# EAGLE design ADS1220RTD_BREWNO_V2 (EAGLE 7.5.0)
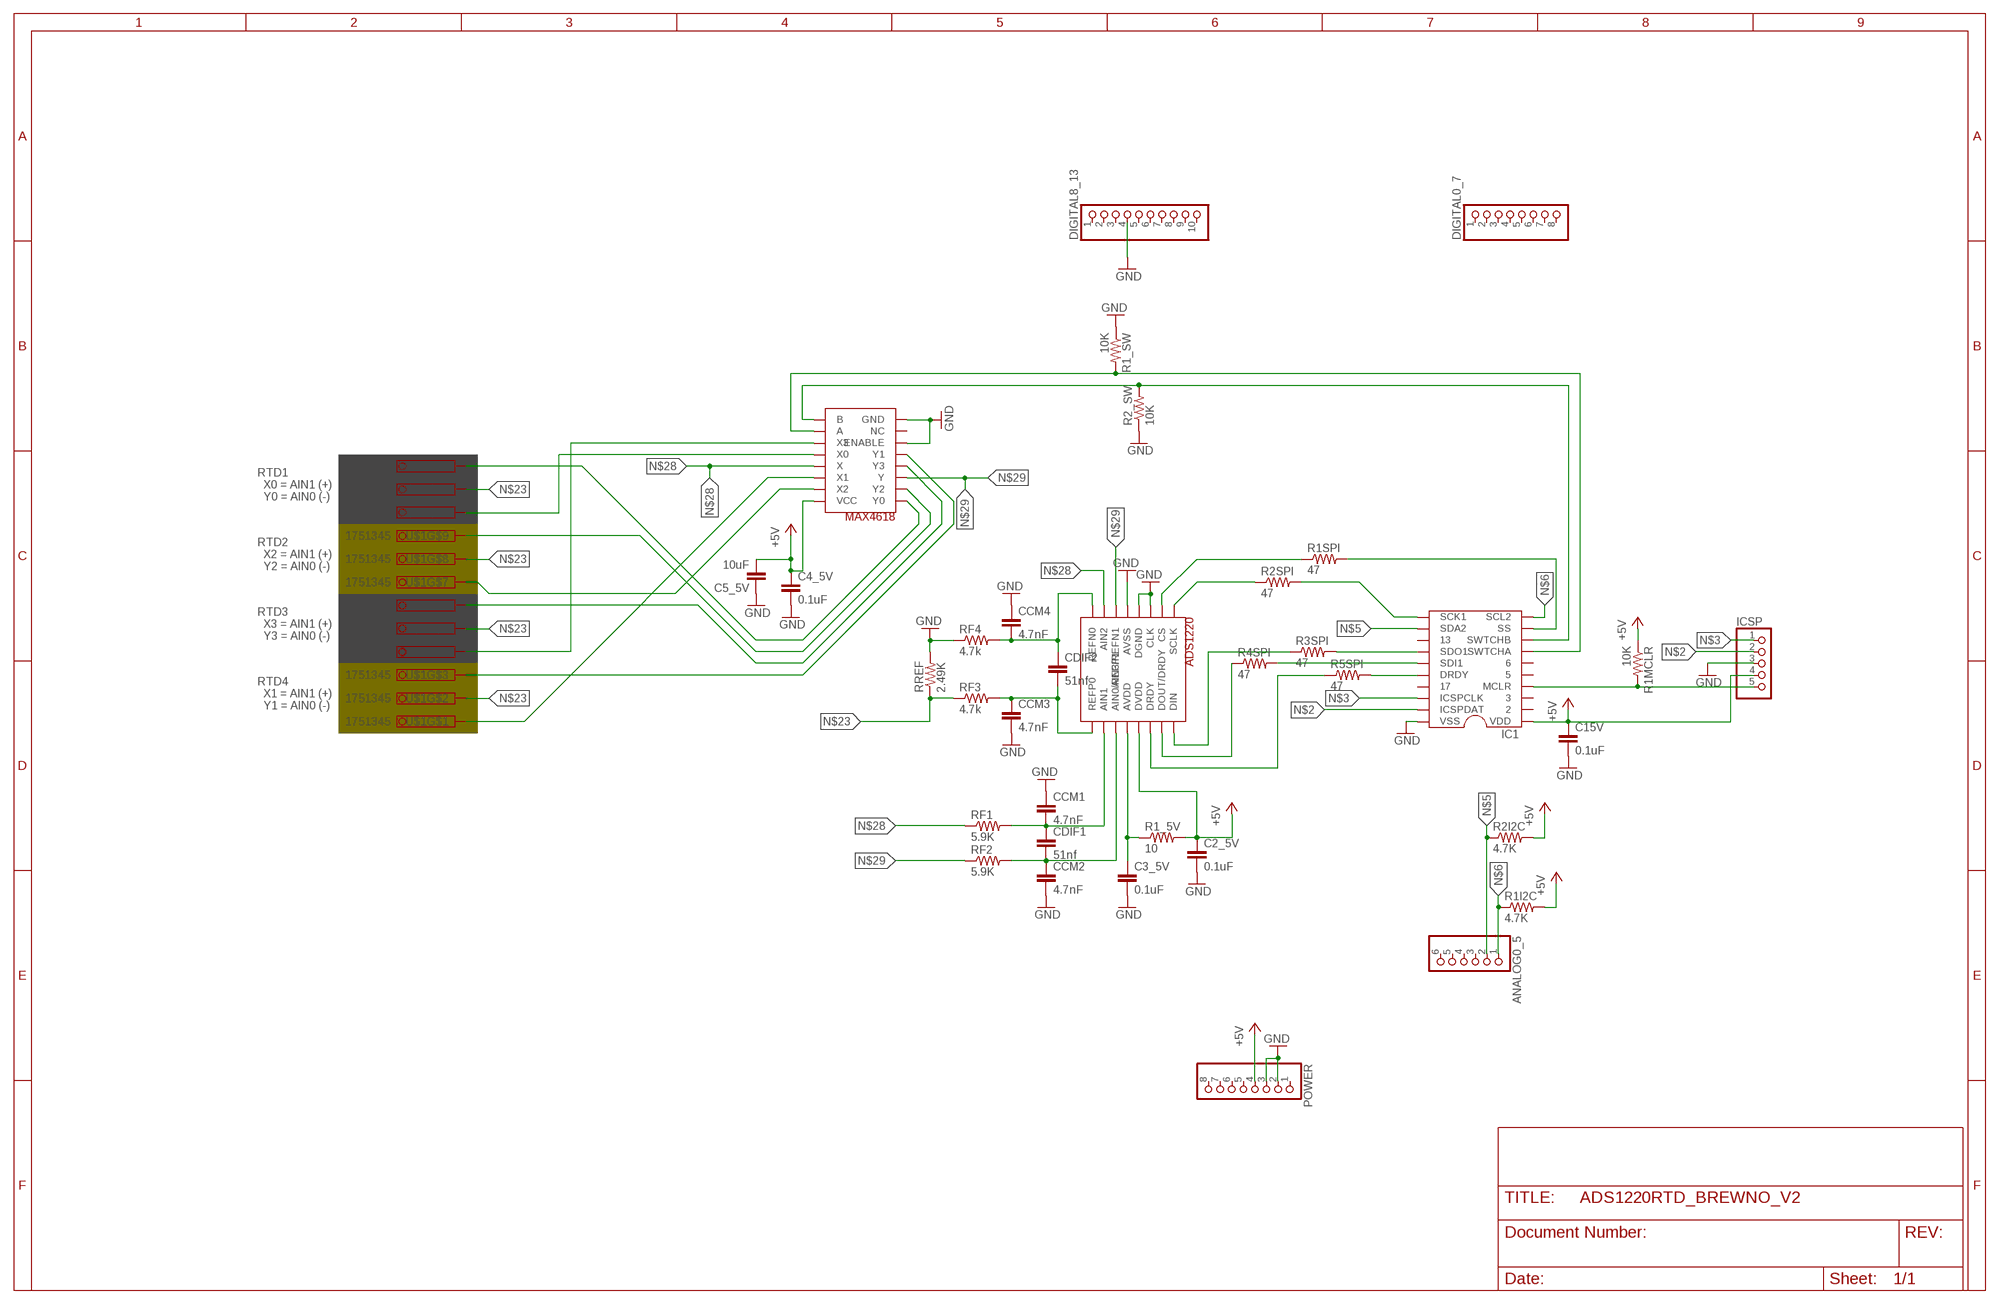
[diagram p0: schematic, sheet 1]

## Parts
ADS1220  ADS1220  [TSSOP16]
ANALOG0_5  PINHD-1X6  [1X06]
C2_5V  0.1uF  C-EUC0603  [C0603]
C3_5V  0.1uF  C-EUC0603  [C0603]
C4_5V  0.1uF  C-EUC0603  [C0603]
C5_5V  10uF  C-EUC0603  [C0603]
C15V  0.1uF  C-EUC0603  [C0603]
CCM1  4.7nF  C-EUC0603  [C0603]
CCM2  4.7nF  C-EUC0603  [C0603]
CCM3  4.7nF  C-EUC0603  [C0603]
CCM4  4.7nF  C-EUC0603  [C0603]
CDIF1  51nf  C-EUC1206  [C1206]
CDIF2  51nf  C-EUC1206  [C1206]
DIGITAL0_7  PINHD-1X8  [1X08]
DIGITAL8_13  PINHD-1X10  [1X10]
IC1  DIL20  [DIL20]
ICSP  PINHD-1X5  [1X05]
MAX4618  MAX4618CPE  [SO16]
POWER  PINHD-1X8  [1X08]
R1_5V  10  R-US_R0603  [R0603]
R1_SW  10K  R-US_R0603  [R0603]
R1I2C  4.7K  R-US_R0603  [R0603]
R1MCLR  10K  R-US_R0603  [R0603]
R1SPI  47  R-US_R0603  [R0603]
R2_SW  10K  R-US_R0603  [R0603]
R2I2C  4.7K  R-US_R0603  [R0603]
R2SPI  47  R-US_R0603  [R0603]
R3SPI  47  R-US_R0603  [R0603]
R4SPI  47  R-US_R0603  [R0603]
R5SPI  47  R-US_R0603  [R0603]
RF1  5.9K  R-US_R0603  [R0603]
RF2  5.9K  R-US_R0603  [R0603]
RF3  4.7k  R-US_R0603  [R0603]
RF4  4.7k  R-US_R0603  [R0603]
RREF  2.49K  R-US_R0603  [R0603]
U$1  1751345  [1751345]

## Nets
+5V: ADS1220.13(DVDD) C2_5V.1 C4_5V.1 C5_5V.2 C15V.1 IC1.1(VDD) ICSP.4 MAX4618.16(VCC) POWER.4 R1_5V.2 R1I2C.2 R1MCLR.1 R2I2C.2
GND: ADS1220.3(CLK) ADS1220.4(DGND) ADS1220.5(AVSS) C2_5V.2 C3_5V.2 C4_5V.2 C5_5V.1 C15V.2 CCM1.1 CCM2.2 CCM3.2 CCM4.1 DIGITAL8_13.4 IC1.20(VSS) ICSP.3 MAX4618.6(ENABLE) MAX4618.8(GND) POWER.2 POWER.3 R1_SW.1 R2_SW.1 RF4.1 RREF.2
N$1: IC1.4(MCLR) ICSP.5 R1MCLR.2
N$2: IC1.19(ICSPDAT) ICSP.2
N$3: IC1.18(ICSPCLK) ICSP.1
N$4: IC1.11(SCK1) R2SPI.2
N$5: ANALOG0_5.2 IC1.12(SDA2) R2I2C.1
N$6: ANALOG0_5.1 IC1.10(SCL2) R1I2C.1
N$7: ADS1220.1(SCLK) R2SPI.1
N$8: ADS1220.2(CS) R1SPI.1
N$9: IC1.9(SS) R1SPI.2
N$10: IC1.14(SDO1) R3SPI.2
N$11: IC1.15(SDI1) R4SPI.2
N$12: ADS1220.14(DRDY) R5SPI.1
N$13: ADS1220.12(AVDD) C3_5V.1 R1_5V.1
N$14: IC1.16(DRDY) R5SPI.2
N$15: ADS1220.16(DIN) R3SPI.1
N$17: ADS1220.15(DOUT/DRDY) R4SPI.1
N$18: IC1.8(SWTCHB) MAX4618.9(B) R2_SW.2
N$19: IC1.7(SWTCHA) MAX4618.10(A) R1_SW.2
N$21: ADS1220.8(REFN0) CCM4.2 CDIF2.1 RF4.2
N$22: ADS1220.9(REFP0) CCM3.1 CDIF2.2 RF3.2
N$23: RF3.1 RREF.1 U$1.2 U$1.5 U$1.8 U$1.11
N$26: ADS1220.11(AIN0/REFP1) CCM2.1 CDIF1.2 RF2.2
N$27: ADS1220.10(AIN1) CCM1.2 CDIF1.1 RF1.2
N$28: ADS1220.7(AIN2) MAX4618.13(X) RF1.1
N$29: ADS1220.6(AIN3/REFN1) MAX4618.3(Y) RF2.1
N$30: MAX4618.1(Y0) U$1.12
N$31: MAX4618.12(X0) U$1.10
N$32: MAX4618.2(Y2) U$1.9
N$33: MAX4618.4(Y3) U$1.6
N$34: MAX4618.15(X2) U$1.7
N$35: MAX4618.5(Y1) U$1.3
N$36: MAX4618.14(X1) U$1.1
N$37: MAX4618.11(X3) U$1.4
Unconnected: ANALOG0_5.3 ANALOG0_5.4 ANALOG0_5.5 ANALOG0_5.6 DIGITAL0_7.1 DIGITAL0_7.2 DIGITAL0_7.3 DIGITAL0_7.4 DIGITAL0_7.5 DIGITAL0_7.6 DIGITAL0_7.7 DIGITAL0_7.8 DIGITAL8_13.1 DIGITAL8_13.2 DIGITAL8_13.3 DIGITAL8_13.5 DIGITAL8_13.6 DIGITAL8_13.7 DIGITAL8_13.8 DIGITAL8_13.9 DIGITAL8_13.10 IC1.2 IC1.3 IC1.5 IC1.6 IC1.13 IC1.17 MAX4618.7(NC) POWER.1 POWER.5 POWER.6 POWER.7 POWER.8

## Notes on the sheet
- RTD1
    X0 = AIN1 (+)
    Y0 = AIN0 (-)
- RTD2
    X2 = AIN1 (+)
    Y2 = AIN0 (-)
- RTD3
    X3 = AIN1 (+)
    Y3 = AIN0 (-)
- RTD4
    X1 = AIN1 (+)
    Y1 = AIN0 (-)

## Library data of the parts
ADS1220 = ADS1220:ADS1220
ANALOG0_5 = pinhead:PINHD-1X6: PIN HEADER
C2_5V C3_5V C4_5V C5_5V C15V CCM1-CCM4 CDIF1 CDIF2 = rcl:C-EU: CAPACITOR, European symbol
DIGITAL0_7 POWER = pinhead:PINHD-1X8: PIN HEADER
DIGITAL8_13 = pinhead:PINHD-1X10: PIN HEADER
IC1 = DW_DPIPs:DIL20: Dual In Line / Socket
ICSP = pinhead:PINHD-1X5: PIN HEADER
MAX4618 = maxim:MAX4618CPE
R1_5V R1_SW R1I2C R1MCLR R1SPI R2_SW R2I2C R2SPI R3SPI R4SPI R5SPI RF1-RF4 RREF = rcl:R-US_: RESISTOR, American symbol
U$1 = con-phoenix-350:1751345

## Board
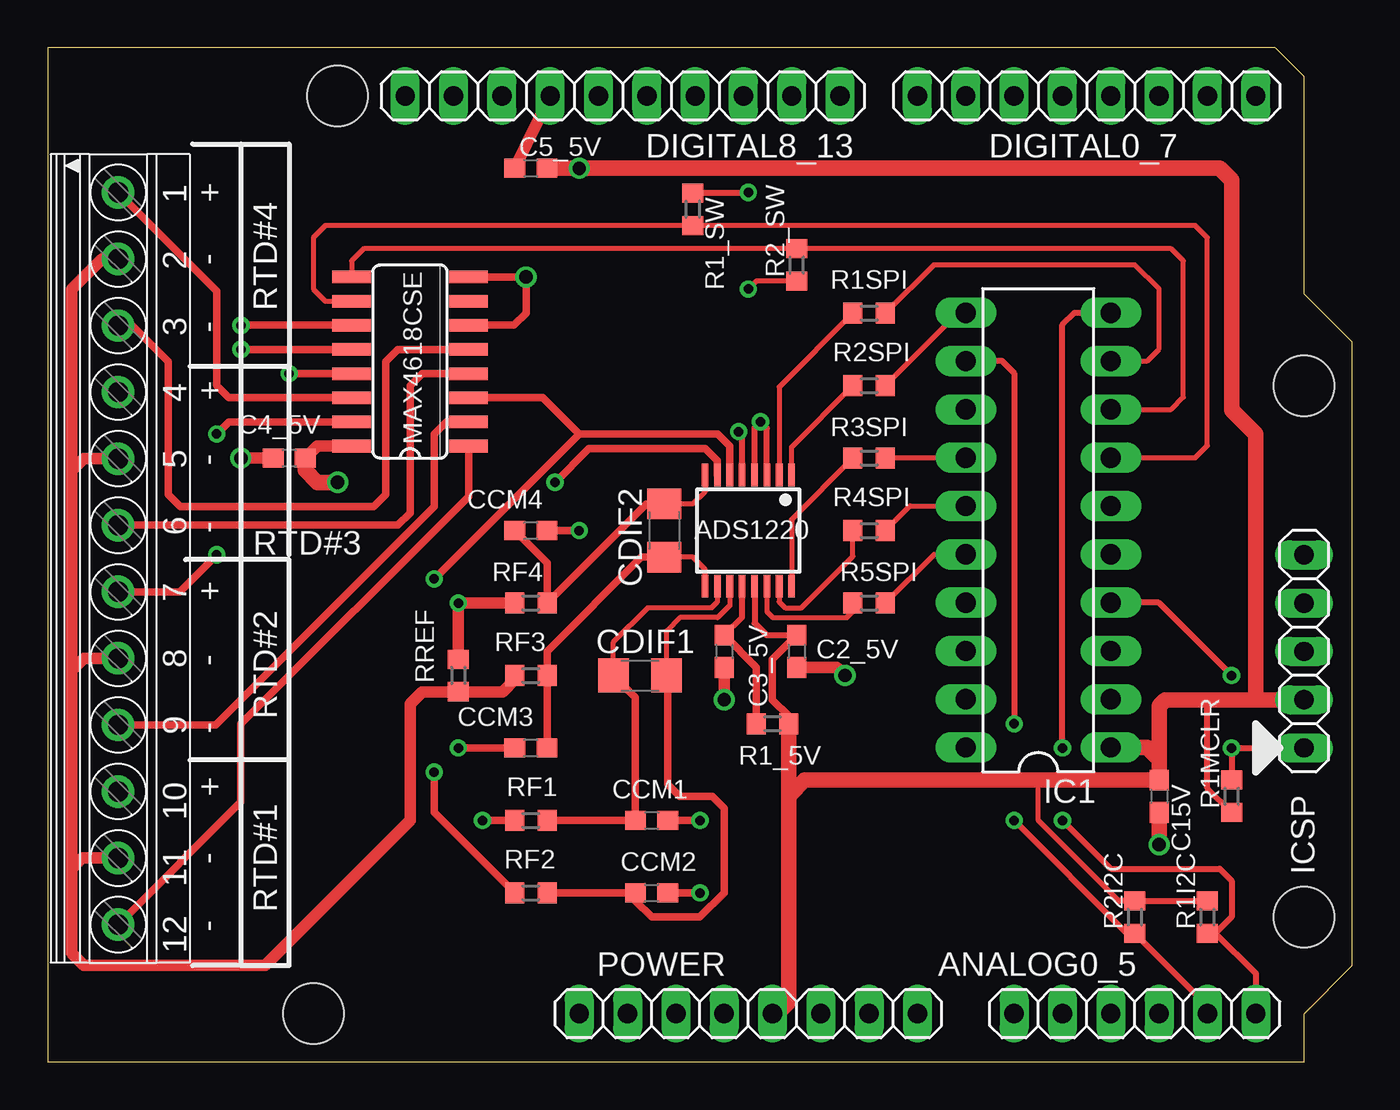
[diagram p1: board, top side]
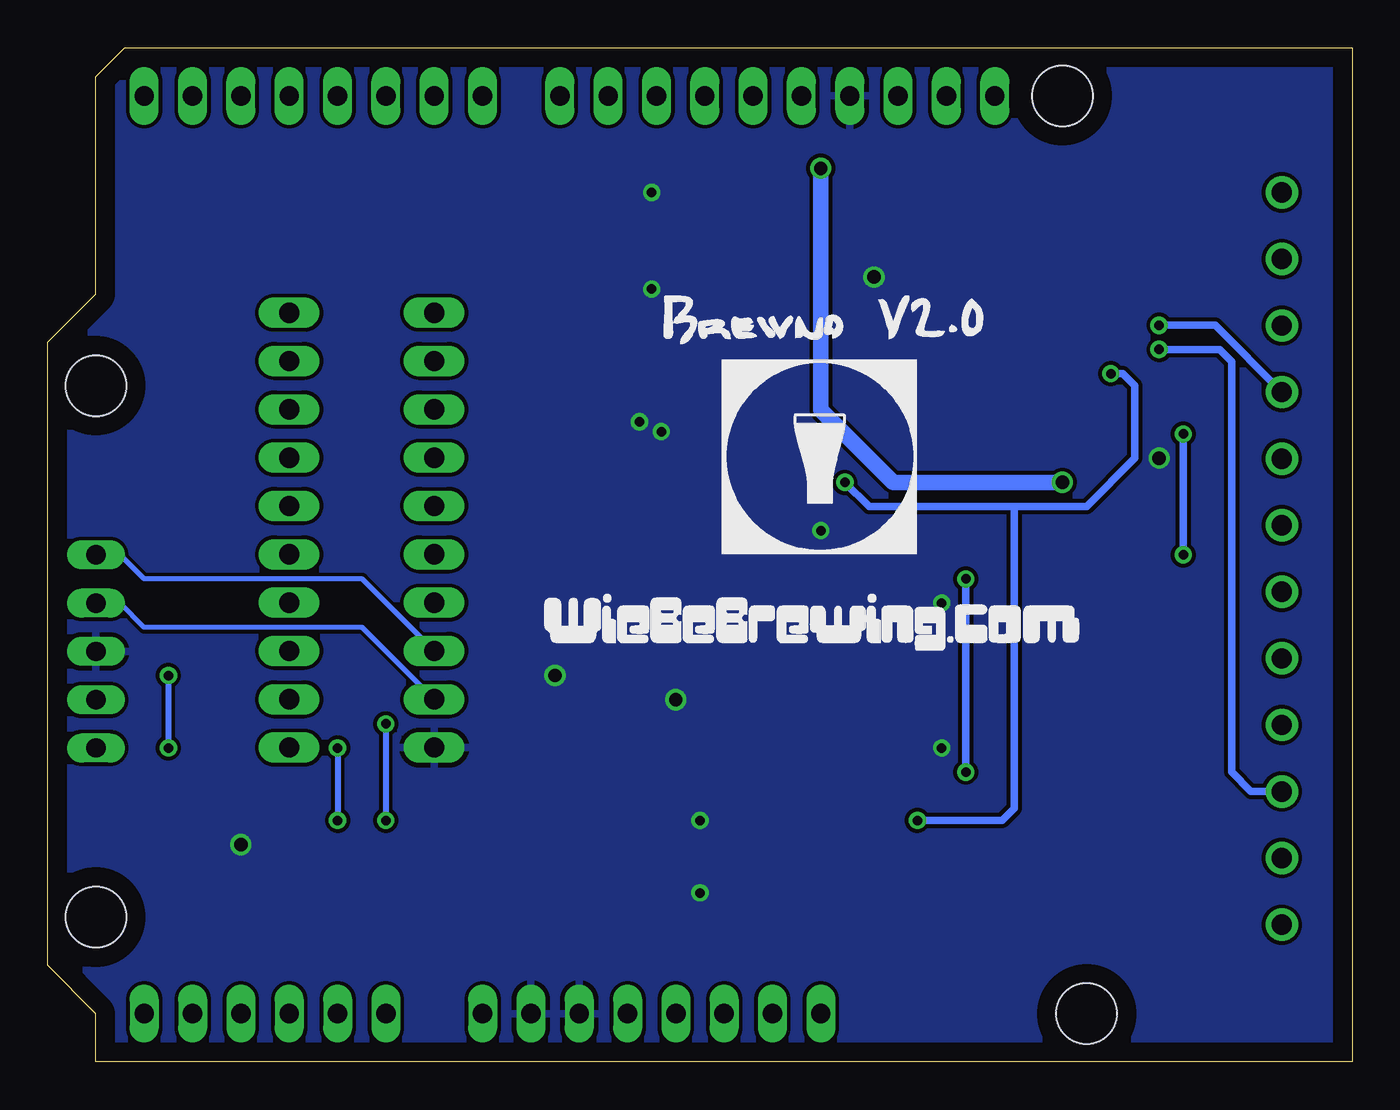
[diagram p2: board, bottom side, seen from below]

Size 68.58 x 53.34 mm. Coordinates in mm from the lower left corner, seen from the top.
Outline: 0,0 66.04,0 66.04,2.54 68.58,5.08 68.58,37.85 66.04,40.39 66.04,51.82 64.52,53.34 0,53.34 0,0
Copper layers (1*16): Top 0.035mm / dielectric 1.5mm / Bottom 0.035mm
Design rules "default *": minimum track width 10mil, minimum drill 19mil, track to track 8mil, track to pad 8mil, pad to pad 8mil, via to via 8mil, smd to smd 8mil, copper to edge 40mil, drill to drill 8mil, minimum pad ring 10mil, minimum via ring 8mil, stop-mask expansion 4mil, vias tented up to drill 0mil, thermal gap 10mil
Holes 3.17 mm at 15.24,50.8 66.04,35.56 66.04,7.62 13.97,2.54

### Footprints (pad centres in the part's own frame; a part is rotated, then mirrored left to right if it is on the bottom)
TSSOP16 = smd 0.35 x 1.2: 1 -2.275,-2.925; 2 -1.625,-2.925; 3 -0.975,-2.925; 4 -0.325,-2.925; 5 0.325,-2.925; 6 0.975,-2.925; 7 1.625,-2.925; 8 2.275,-2.925; 9 2.275,2.925; 10 1.625,2.925; 11 0.975,2.925; 12 0.325,2.925; 13 -0.325,2.925; 14 -0.975,2.925; 15 -1.625,2.925; 16 -2.275,2.925
1X06 = drill 1.016 long: 1 -6.35,0; 2 -3.81,0; 3 -1.27,0; 4 1.27,0; 5 3.81,0; 6 6.35,0
C0603 = smd 1.1 x 1: 1 -0.85,0; 2 0.85,0
C1206 = smd 1.6 x 1.8: 1 -1.4,0; 2 1.4,0
1X08 = drill 1.016 long: 1 -8.89,0; 2 -6.35,0; 3 -3.81,0; 4 -1.27,0; 5 1.27,0; 6 3.81,0; 7 6.35,0; 8 8.89,0
1X10 = drill 1.016 long: 1 -11.43,0; 2 -8.89,0; 3 -6.35,0; 4 -3.81,0; 5 -1.27,0; 6 1.27,0; 7 3.81,0; 8 6.35,0; 9 8.89,0; 10 11.43,0
DIL20 = drill 1.067 long: 1 -11.43,-3.81; 2 -8.89,-3.81; 3 -6.35,-3.81; 4 -3.81,-3.81; 5 -1.27,-3.81; 6 1.27,-3.81; 7 3.81,-3.81; 8 6.35,-3.81; 9 8.89,-3.81; 10 11.43,-3.81; 11 11.43,3.81; 12 8.89,3.81; 13 6.35,3.81; 14 3.81,3.81; 15 1.27,3.81; 16 -1.27,3.81; 17 -3.81,3.81; 18 -6.35,3.81; 19 -8.89,3.81; 20 -11.43,3.81
1X05 = drill 1.016 long: 1 -5.08,0; 2 -2.54,0; 3 0,0; 4 2.54,0; 5 5.08,0
SO16 = smd 0.66 x 2.032: 1 -4.445,-3.073; 2 -3.175,-3.073; 3 -1.905,-3.073; 4 -0.635,-3.073; 5 0.635,-3.073; 6 1.905,-3.073; 7 3.175,-3.073; 8 4.445,-3.073; 9 4.445,3.073; 10 3.175,3.073; 11 1.905,3.073; 12 0.635,3.073; 13 -0.635,3.073; 14 -1.905,3.073; 15 -3.175,3.073; 16 -4.445,3.073
R0603 = smd 1 x 1.1: 1 -0.85,0; 2 0.85,0
1751345 = drill 1.067 pad 1.7: 1 -13.973,-0.1; 2 -10.473,-0.1; 3 -6.973,-0.1; 4 -3.473,-0.1; 5 0.028,-0.1; 6 3.527,-0.1; 7 7.027,-0.1; 8 10.527,-0.1; 9 14.027,-0.1; 10 17.527,-0.1; 11 21.027,-0.1; 12 24.527,-0.1

### Placement (x,y rotation side)
ADS1220  36.83,27.94 180 top
ANALOG0_5  57.15,2.54 180 top
C2_5V  39.37,21.59 270 top
C3_5V  35.56,21.59 270 top
C4_5V  12.7,31.75 180 top
C5_5V  25.4,46.99 0 top
C15V  58.42,13.97 270 top
CCM1  31.75,12.7 180 top
CCM2  31.75,8.89 0 top
CCM3  25.4,16.51 180 top
CCM4  25.4,27.94 180 top
CDIF1  31.14,20.32 0 top
CDIF2  32.41,27.94 270 top
DIGITAL0_7  54.61,50.8 0 top
DIGITAL8_13  30.23,50.8 0 top
IC1  52.07,27.97 90 top
ICSP  66.04,21.59 270 top
MAX4618  19.05,36.83 90 top
POWER  36.83,2.54 180 top
R1_5V  38.1,17.78 0 top
R1_SW  33.91,44.83 270 top
R1I2C  60.96,7.62 90 top
R1MCLR  62.23,13.97 90 top
R1SPI  43.18,39.37 0 top
R2_SW  39.37,41.91 90 top
R2I2C  57.15,7.62 90 top
R2SPI  43.18,35.56 0 top
R3SPI  43.18,31.75 0 top
R4SPI  43.18,27.94 0 top
R5SPI  43.18,24.13 0 top
RF1  25.4,12.7 0 top
RF2  25.4,8.89 0 top
RF3  25.4,20.32 0 top
RF4  25.4,24.13 0 top
RREF  21.59,20.32 90 top
U$1  3.81,31.75 270 top

### Tracks (layer width: path | path; a pad name or v marks a point on that pad's centre or on a via)
+5V  (via drill 0.7)
  Top 0.254: 56.3,8.47 52.07,12.7 52.07,14.82
  Top 0.305: ADS1220.13 37.16,23.07 37.79,22.44 C2_5V.1 | R1MCLR.1 60.96,14.39 60.96,19.05 | 56.3,8.47 R2I2C.2 R1I2C.2
  Top 0.406: C2_5V.1 38.1,21.17 38.1,19.05 38.95,18.2 R1_5V.2
  Top 0.61: C4_5V.1 14.19,32.38 MAX4618.16
  Top 0.813: POWER.4 38.31,2.54 38.95,3.17 38.95,13.97 | 38.95,13.97 R1_5V.2 | 38.95,13.97 39.8,14.82 52.07,14.82 C15V.1 58.42,15.88 58.42,15.9 | 58.42,15.9 58.42,18.73 58.74,19.05 60.96,19.05 63.5,19.05 | 63.5,19.05 ICSP.4 | C5_5V.2 v27.94,46.99 61.59,46.99 62.23,46.35 62.23,34.29 63.5,33.02 63.5,19.05 | C4_5V.1 13.55,31.11 14.19,30.48 v15.24,30.48 | 58.42,15.9 57.78,16.54 IC1.1
  Bottom 0.813: v27.94,46.99 27.94,34.29 24.13,30.48 v15.24,30.48
GND  (via drill 0.5, 0.7)
  Top 0.254: R2_SW.1 37.25,41.06 v36.83,40.64
  Top 0.305: ADS1220.3 37.8,33.31 v37.47,33.66 37.16,33.34 ADS1220.4 | ADS1220.5 36.51,32.96 v36.32,33.15 | R1_SW.1 33.95,45.72 v36.83,45.72
  Top 0.406: CCM1.1 v34.29,12.7 | CCM2.2 v34.29,8.89 | v21.59,16.51 CCM3.2 | CCM4.1 v27.94,27.94 | MAX4618.8 v25.15,41.27 25.15,39.37 24.51,38.73 MAX4618.6
  Top 0.61: C2_5V.2 41.49,20.74 v41.91,20.32 | C3_5V.2 v35.56,19.05 | RREF.2 v21.59,24.13 RF4.1 | C4_5V.2 v10.16,31.75 | C5_5V.1 DIGITAL8_13.4
  Top 0.813: C15V.2 v58.42,11.43
  pour Bottom: 0,0 66.04,0 66.04,2.54 68.58,5.08 68.58,38.1 66.04,40.64 66.04,52.07 64.77,53.34 0,53.34
N$1  (via drill 0.5)
  Top 0.305: ICSP.5 v62.23,16.51 R1MCLR.2 | v62.23,20.32 58.4,24.16 IC1.4
  Bottom 0.305: v62.23,20.32 v62.23,16.51
N$2
  Bottom 0.254: ICSP.2 64.77,24.13 63.5,22.86 52.05,22.86 IC1.19
N$3
  Bottom 0.254: ICSP.1 64.77,26.67 63.5,25.4 52.05,25.4 IC1.18
N$4
  Top 0.254: R2SPI.2 47.87,39.4 IC1.11
N$5  (via drill 0.5)
  Top 0.305: v50.8,17.78 50.8,36.22 50.16,36.85 IC1.12 | v50.8,12.7 56.73,6.77 R2I2C.1 60.96,2.96 ANALOG0_5.2
  Bottom 0.305: v50.8,17.78 v50.8,12.7
N$6  (via drill 0.5)
  Top 0.305: v53.34,12.7 55.88,10.16 61.59,10.16 62.23,9.53 62.23,7.62 61.38,6.77 | 61.38,6.77 R1I2C.1 | 61.38,6.77 63.5,4.65 ANALOG0_5.1 | v53.34,16.51 53.34,38.76 53.98,39.4 IC1.10
  Bottom 0.305: v53.34,16.51 v53.34,12.7
N$7
  Top 0.254: ADS1220.1 39.1,32.34 R2SPI.1
N$8
  Top 0.254: R1SPI.1 38.45,35.49 ADS1220.2
N$9
  Top 0.254: R1SPI.2 46.57,41.91 57.15,41.91 58.42,40.64 58.42,37.49 57.78,36.85 IC1.9
N$10
  Top 0.254: R3SPI.2 44.05,31.77 IC1.14
N$11
  Top 0.254: R4SPI.2 45.33,29.23 IC1.15
N$12
  Top 0.254: ADS1220.14 37.8,23.69 38.12,23.37 42.01,23.37 42.33,23.69 R5SPI.1
N$13
  Top 0.305: C3_5V.1 36.51,23.39 ADS1220.12
  Top 0.406: R1_5V.1 37.25,20.75 C3_5V.1
N$14
  Top 0.254: R5SPI.2 46.59,26.7 IC1.16
N$15
  Top 0.254: R3SPI.1 39.1,28.52 ADS1220.16
N$17
  Top 0.254: ADS1220.15 38.45,24.19 38.77,23.88 39.62,23.88 42.33,26.58 R4SPI.1
N$18
  Top 0.254: MAX4618.9 15.98,42.12 16.61,42.76 R2_SW.2 59.05,42.76 59.69,42.12 59.69,34.95 59.05,34.31 IC1.8
N$19
  Top 0.254: MAX4618.10 14.61,40.01 13.97,40.64 13.97,43.35 14.61,43.98 R1_SW.2 60.33,43.98 60.96,43.35 60.96,32.41 60.33,31.77 IC1.7
N$21
  Top 0.254: ADS1220.8 34.55,29.98 33.92,29.34 CDIF2.1
  Top 0.406: CCM4.2 26.25,26.24 RF4.2 31.46,29.34 CDIF2.1
N$22
  Top 0.254: ADS1220.9 34.55,25.91 33.92,26.54 CDIF2.2
  Top 0.406: CCM3.1 RF3.2 26.25,21.59 31.2,26.54 CDIF2.2
N$23
  Top 0.406: 24.55,20.11 RF3.1
  Top 0.61: 24.55,20.11 23.91,19.47 RREF.1 19.68,19.47 19.05,18.84 19.05,12.7 11.43,5.08 1.91,5.08 1.27,5.71 1.27,10.16 | 1.27,10.16 1.27,20.59 | 1.27,20.59 1.27,31.09 | 1.27,31.09 1.27,40.64 2.85,42.22 U$1.2 | U$1.11 1.83,10.72 1.27,10.16 | U$1.8 1.91,21.22 1.27,20.59 | U$1.5 1.91,31.72 1.27,31.09
N$26
  Top 0.254: ADS1220.11 35.85,24 35.22,23.37 33.23,23.37 32.54,22.67 CDIF1.2
  Top 0.406: RF2.2 CCM2.1 30.9,8.47 31.75,7.62 34.29,7.62 35.56,8.89 35.56,13.34 34.92,13.97 33.23,13.97 32.6,14.61 32.6,20.32 CDIF1.2
N$27
  Top 0.254: ADS1220.10 35.2,24.19 34.89,23.88 31.54,23.88 29.74,22.08 CDIF1.1
  Top 0.406: RF1.2 CCM1.2 30.9,19.16 CDIF1.1
N$28  (via drill 0.5)
  Top 0.406: ADS1220.7 35.2,31.62 34.57,32.26 28.45,32.26 v26.67,30.48 | v12.7,36.2 MAX4618.13 | RF1.1 v22.86,12.7
  Bottom 0.406: v26.67,30.48 25.4,29.21 17.78,29.21 | 17.78,29.21 13.97,29.21 11.43,31.75 11.43,35.56 12.06,36.2 v12.7,36.2 | v22.86,12.7 18.41,12.7 17.78,13.34 17.78,29.21
N$29  (via drill 0.5)
  Top 0.406: ADS1220.6 35.85,32.38 35.22,33.02 27.94,33.02 | 27.94,33.02 26.04,34.92 MAX4618.3 | RF2.1 20.32,13.12 v20.32,15.24 | v20.32,25.4 27.94,33.02
  Bottom 0.406: v20.32,15.24 v20.32,25.4
N$30
  Top 0.406: MAX4618.1 22.12,29.74 10.16,17.78 10.16,13.67 U$1.12
N$31  (via drill 0.5)
  Top 0.406: MAX4618.12 v10.16,37.47
  Bottom 0.406: v10.16,37.47 6.99,37.47 6.35,36.83 6.35,15.24 5.33,14.22 U$1.10
N$32
  Top 0.406: MAX4618.2 20.95,33.66 20.32,33.02 20.32,29.21 8.83,17.72 U$1.9
N$33
  Top 0.406: MAX4618.4 19.68,36.2 19.05,35.56 19.05,28.86 18.41,28.22 U$1.6
N$34  (via drill 0.5)
  Top 0.406: MAX4618.15 9.53,33.66 v8.89,33.02 | v8.89,26.67 6.94,24.72 U$1.7
  Bottom 0.406: v8.89,33.02 v8.89,26.67
N$35
  Top 0.406: MAX4618.5 18.41,37.47 17.78,36.83 17.78,29.84 17.14,29.21 6.99,29.21 6.35,29.84 6.35,36.83 4.46,38.72 U$1.3
N$36
  Top 0.406: MAX4618.14 9.53,34.92 8.89,35.56 8.89,40.54 U$1.1
N$37  (via drill 0.5)
  Top 0.406: MAX4618.11 v10.16,38.73
  Bottom 0.406: v10.16,38.73 7.22,38.73 U$1.4

### Text on the board
tPlace: MAX4618CSE
tNames: + | - | RTD#4 | - | + | - | - | RTD#3 | + | - | RTD#2 | - | + | - | RTD#1 | -